# EAGLE design vis-spi-out (EAGLE 9.6.2)

## Sheet 1 of 3
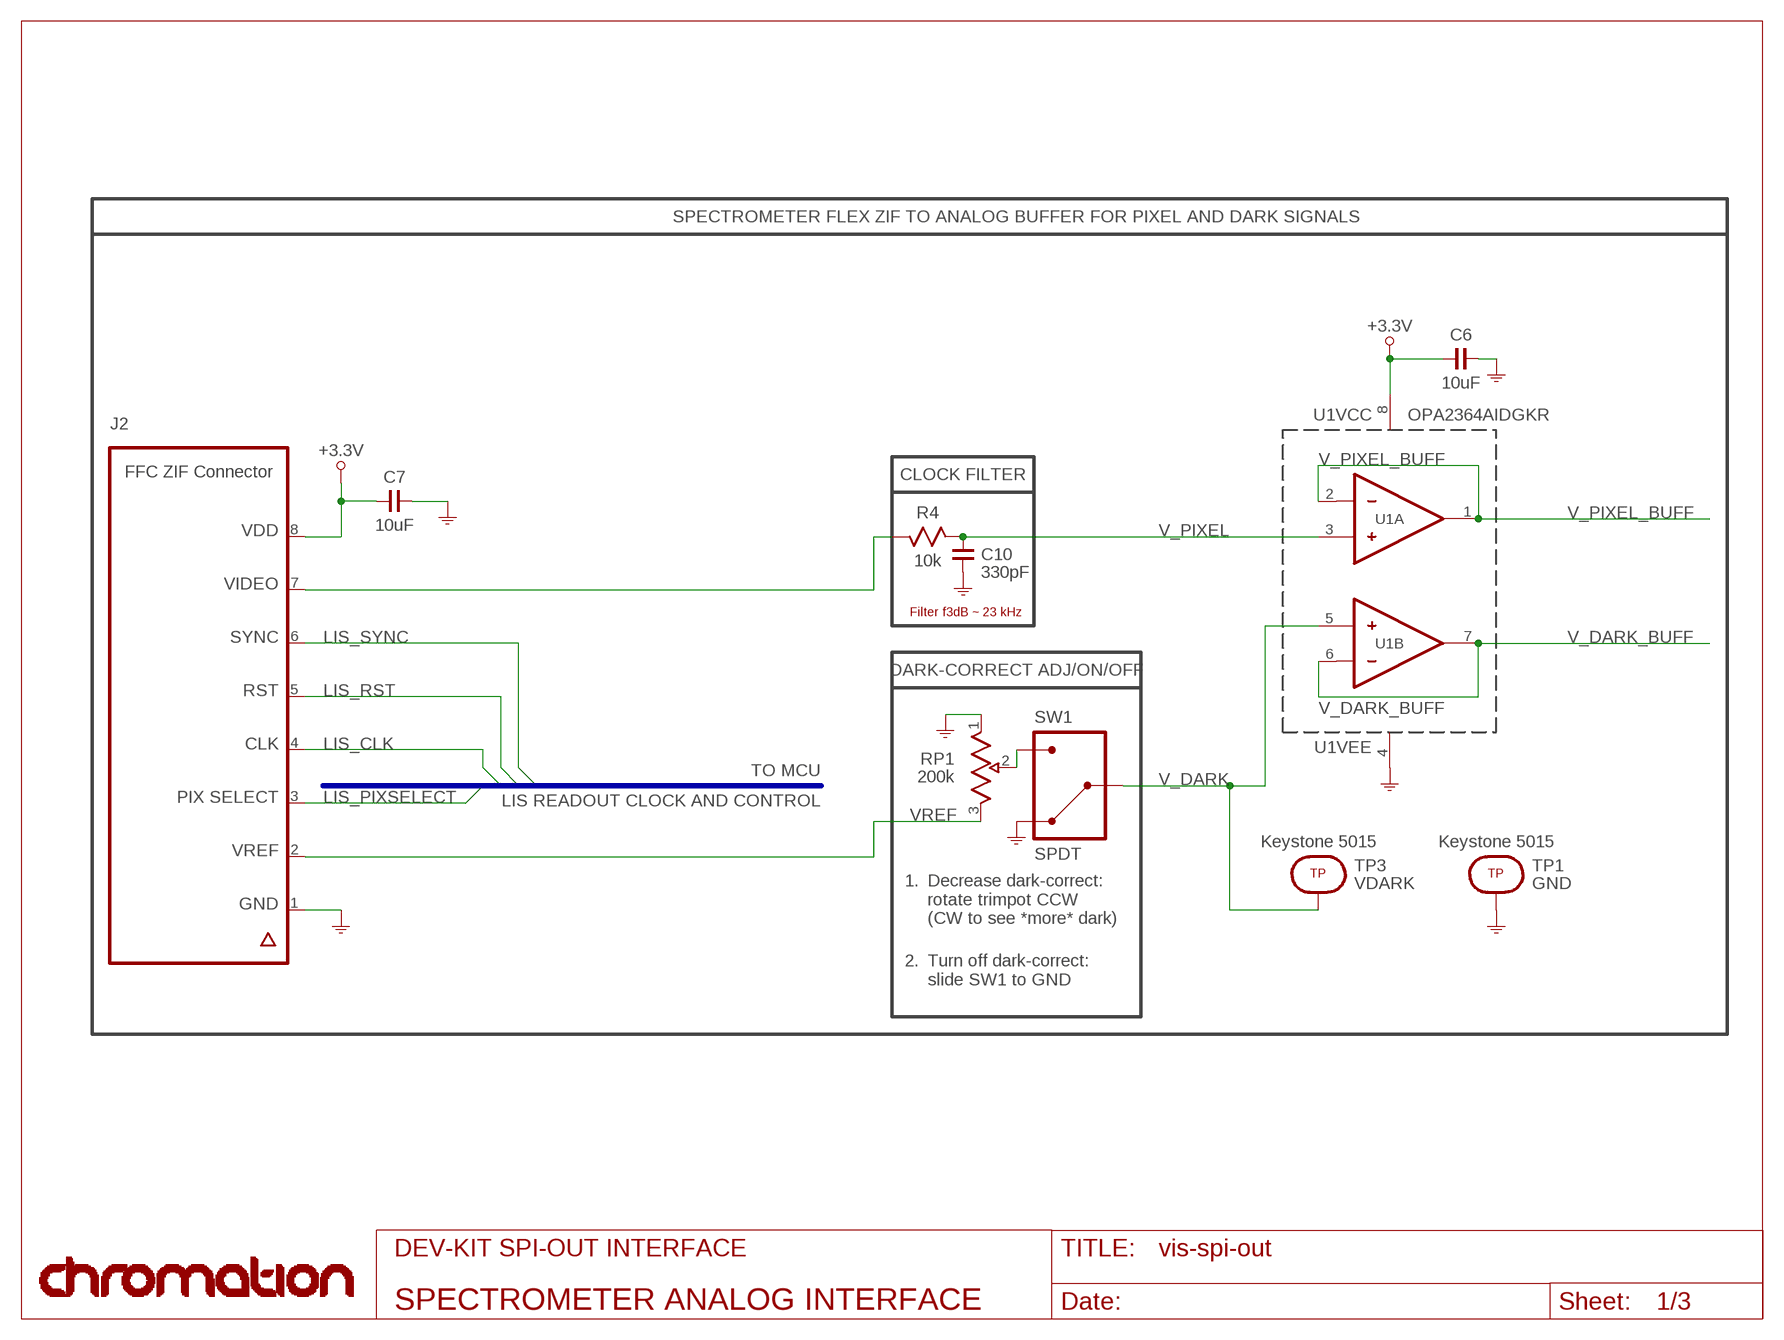
[diagram p0: schematic, sheet 1]

### Parts
C6  10uF  C_0603  [0603]
C7  10uF  C_0603  [0603]
C10  330pF  C_0603  [0603]
J2  FFC ZIF Connector  ZIF_8-PIN  [FH12-8S-0.5SH]
R4  10k  R_0603  [0603]
RP1  200k  TRIMPOT_3MM-SMD  [TC3XX-2-204E]
SW1  SPDT  SW_SPDT_JS102011JCQN  [JS102011JCQN]
TP1  Keystone 5015  TEST-POINT_SMT-5015  [SMT-TEST-POINT-5015]
TP3  Keystone 5015  TEST-POINT_SMT-5015  [SMT-TEST-POINT-5015]
U1  OPA2364AIDGKR  OPA2364_VSSOP-8  [DGK]

### Nets
+3.3V: C6.2 C7.2 J2.8 U1.8(VCC:VCC) ; also sheet 2,3
GND: C6.1 C7.1 C10.2 J2.1 RP1.1(CCW) SW1.3 TP1.1 U1.4(VEE:VEE) ; also sheet 2,3
LIS_CLK: J2.4 ; also sheet 2
LIS_PIXSELECT: J2.3 ; also sheet 2
LIS_RST: J2.5 ; also sheet 2
LIS_SYNC: J2.6 ; also sheet 2
V_DARK: SW1.2 TP3.1 U1.5(B:IN+)
V_DARK_BUFF: U1.6(B:IN-) U1.7(B:OUT) ; also sheet 2
V_PIXEL: C10.1 R4.2 U1.3(A:IN+)
V_PIXEL_BUFF: U1.1(A:OUT) U1.2(A:IN-) ; also sheet 2
VIDEO: J2.7 R4.1
VREF: J2.2 RP1.3(CW)
WIPER: RP1.2(WIPER) SW1.1
Unconnected: J2.LEG@1(LEG) J2.LEG@2(LEG)

### Buses
LIS_PIXSELECT,LIS_CLK,LIS_RST,LIS_SYNC

### Notes on the sheet
- SPECTROMETER FLEX ZIF TO ANALOG BUFFER FOR PIXEL AND DARK SIGNALS
- CLOCK FILTER
- VDD
- VIDEO
- Filter f3dB ~ 23 kHz
- SYNC
- DARK-CORRECT ADJ/ON/OFF
- RST
- CLK
- TO MCU
- LIS READOUT CLOCK AND CONTROL
- PIX SELECT
- VREF
- 1.
- Decrease dark-correct:
  rotate trimpot CCW
  (CW to see *more* dark)
- GND
- 2.
- Turn off dark-correct:
  slide SW1 to GND
- DEV-KIT SPI-OUT INTERFACE
- SPECTROMETER ANALOG INTERFACE

## Sheet 2 of 3
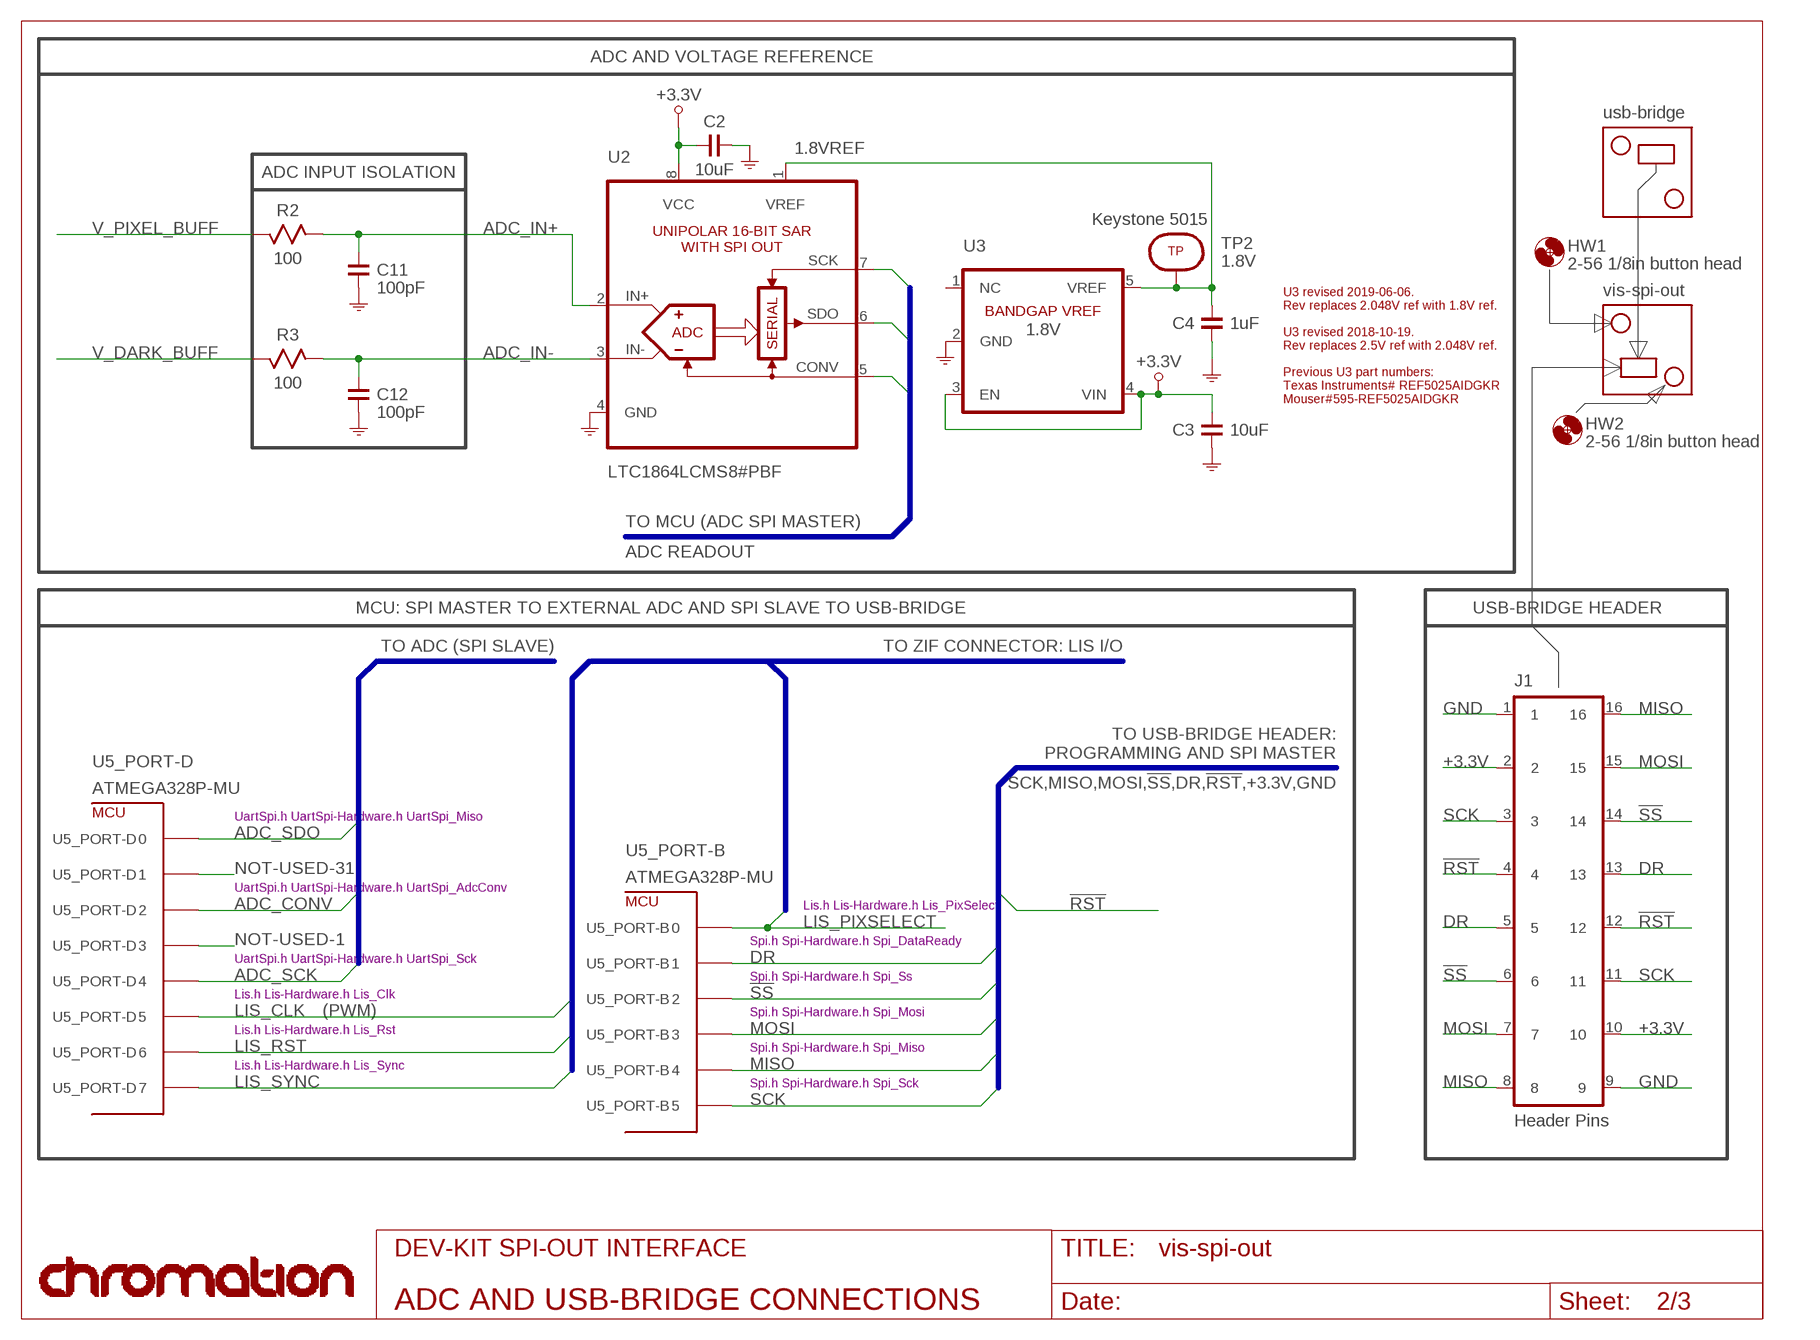
[diagram p1: schematic, sheet 2]

### Parts
C2  10uF  C_0603  [0603]
C3  10uF  C_0603  [0603]
C4  1uF  C_0603  [0603]
C11  100pF  C_0603  [0603]
C12  100pF  C_0603  [0603]
HW1  2-56 1/8in button head  MOUNTING-HOLE_2-56_SCREW  [MCMASTER_92949A081]
HW2  2-56 1/8in button head  MOUNTING-HOLE_2-56_SCREW  [MCMASTER_92949A081]
J1  Header Pins  HEADER-PIN_2X8  [TSM-108-01-S-DV]
R2  100  R_0603  [0603]
R3  100  R_0603  [0603]
ROTATED-USB-BRIDGE-PCB  USB-BRIDGE_FOOTPRINT-AND-USB-REF  [OUTLINE-HEADER-MICROUSB]
TP2  Keystone 5015  TEST-POINT_SMT-5015  [SMT-TEST-POINT-5015]
U2  LTC1864LCMS8#PBF  LTC1864L_CMS8  [LTC1864LCMS8]
U3  1.8V  VREF_SOT23-LM4132  [SOT23]
U5  ATMEGA328P-MU  [QFN-32_ATMEL]
USB-BRDIGE-PCB  USB-BRIDGE_FOOTPRINT-AND-USB-REF  [OUTLINE-HEADER-MICROUSB]

### Nets
1.8VREF: C4.2 TP2.1 U2.1(VREF) U3.5(VREF)
!RST!: J1.4 J1.12 ; also sheet 3
!SS!: J1.6 J1.14 U5.14 U5.14F
+3.3V: C2.2 C3.1 J1.2 J1.10 U2.8(VCC) U3.3(EN) U3.4(VIN) ; also sheet 1,3
ADC_CONV: U2.5(CONV) U5.32 U5.32F
ADC_IN+: C11.1 R2.2 U2.2(IN+)
ADC_IN-: C12.1 R3.2 U2.3(IN-)
ADC_SCK: U2.7(SCK) U5.2 U5.2F
ADC_SDO: U2.6(SDO) U5.30 U5.30F
DR: J1.5 J1.13 U5.13 U5.13F
GND: C2.1 C3.2 C4.1 C11.2 C12.2 J1.1 J1.9 U2.4(GND) U3.2(GND) ; also sheet 1,3
LIS_CLK: U5.9 U5.9F ; also sheet 1
LIS_PIXSELECT: U5.12 U5.12F ; also sheet 1
LIS_RST: U5.10 U5.10F ; also sheet 1
LIS_SYNC: U5.11 U5.11F ; also sheet 1
MISO: J1.8 J1.16 U5.16 U5.16F
MOSI: J1.7 J1.15 U5.15 U5.15F
NOT-USED-1: U5.1 U5.1F
NOT-USED-31: U5.31 U5.31F
SCK: J1.3 J1.11 U5.17 U5.17F
V_DARK_BUFF: R3.1 ; also sheet 1
V_PIXEL_BUFF: R2.1 ; also sheet 1
Unconnected: U3.1(NC)

### Buses
ADC_SCK,ADC_SDO,ADC_CONV
LIS_PIXSELECT,LIS_CLK,LIS_RST,LIS_SYNC
SCK,MISO,MOSI,!SS!,DR,!RST!,+3.3V,GND

### Notes on the sheet
- ADC AND VOLTAGE REFERENCE
- usb-bridge
- ADC INPUT ISOLATION
- U3 revised 2019-06-06.
  Rev replaces 2.048V ref with 1.8V ref.
  
  U3 revised 2018-10-19.
  Rev replaces 2.5V ref with 2.048V ref.
  
  Previous U3 part numbers:
  Texas Instruments# REF5025AIDGKR
  Mouser#595-REF5025AIDGKR
- vis-spi-out
- TO MCU (ADC SPI MASTER)
- ADC READOUT
- MCU: SPI MASTER TO EXTERNAL ADC AND SPI SLAVE TO USB-BRIDGE | USB-BRIDGE HEADER
- TO ADC (SPI SLAVE) | TO ZIF CONNECTOR: LIS I/O
- TO USB-BRIDGE HEADER:
  PROGRAMMING AND SPI MASTER
- UartSpi.h UartSpi-Hardware.h UartSpi_Miso
- UartSpi.h UartSpi-Hardware.h UartSpi_AdcConv
- Lis.h Lis-Hardware.h Lis_PixSelect
- Spi.h Spi-Hardware.h Spi_DataReady
- UartSpi.h UartSpi-Hardware.h UartSpi_Sck
- Spi.h Spi-Hardware.h Spi_Ss
- Lis.h Lis-Hardware.h Lis_Clk
- (PWM) | Spi.h Spi-Hardware.h Spi_Mosi
- Lis.h Lis-Hardware.h Lis_Rst
- Spi.h Spi-Hardware.h Spi_Miso
- Lis.h Lis-Hardware.h Lis_Sync
- Spi.h Spi-Hardware.h Spi_Sck
- DEV-KIT SPI-OUT INTERFACE
- ADC AND USB-BRIDGE CONNECTIONS

## Sheet 3 of 3
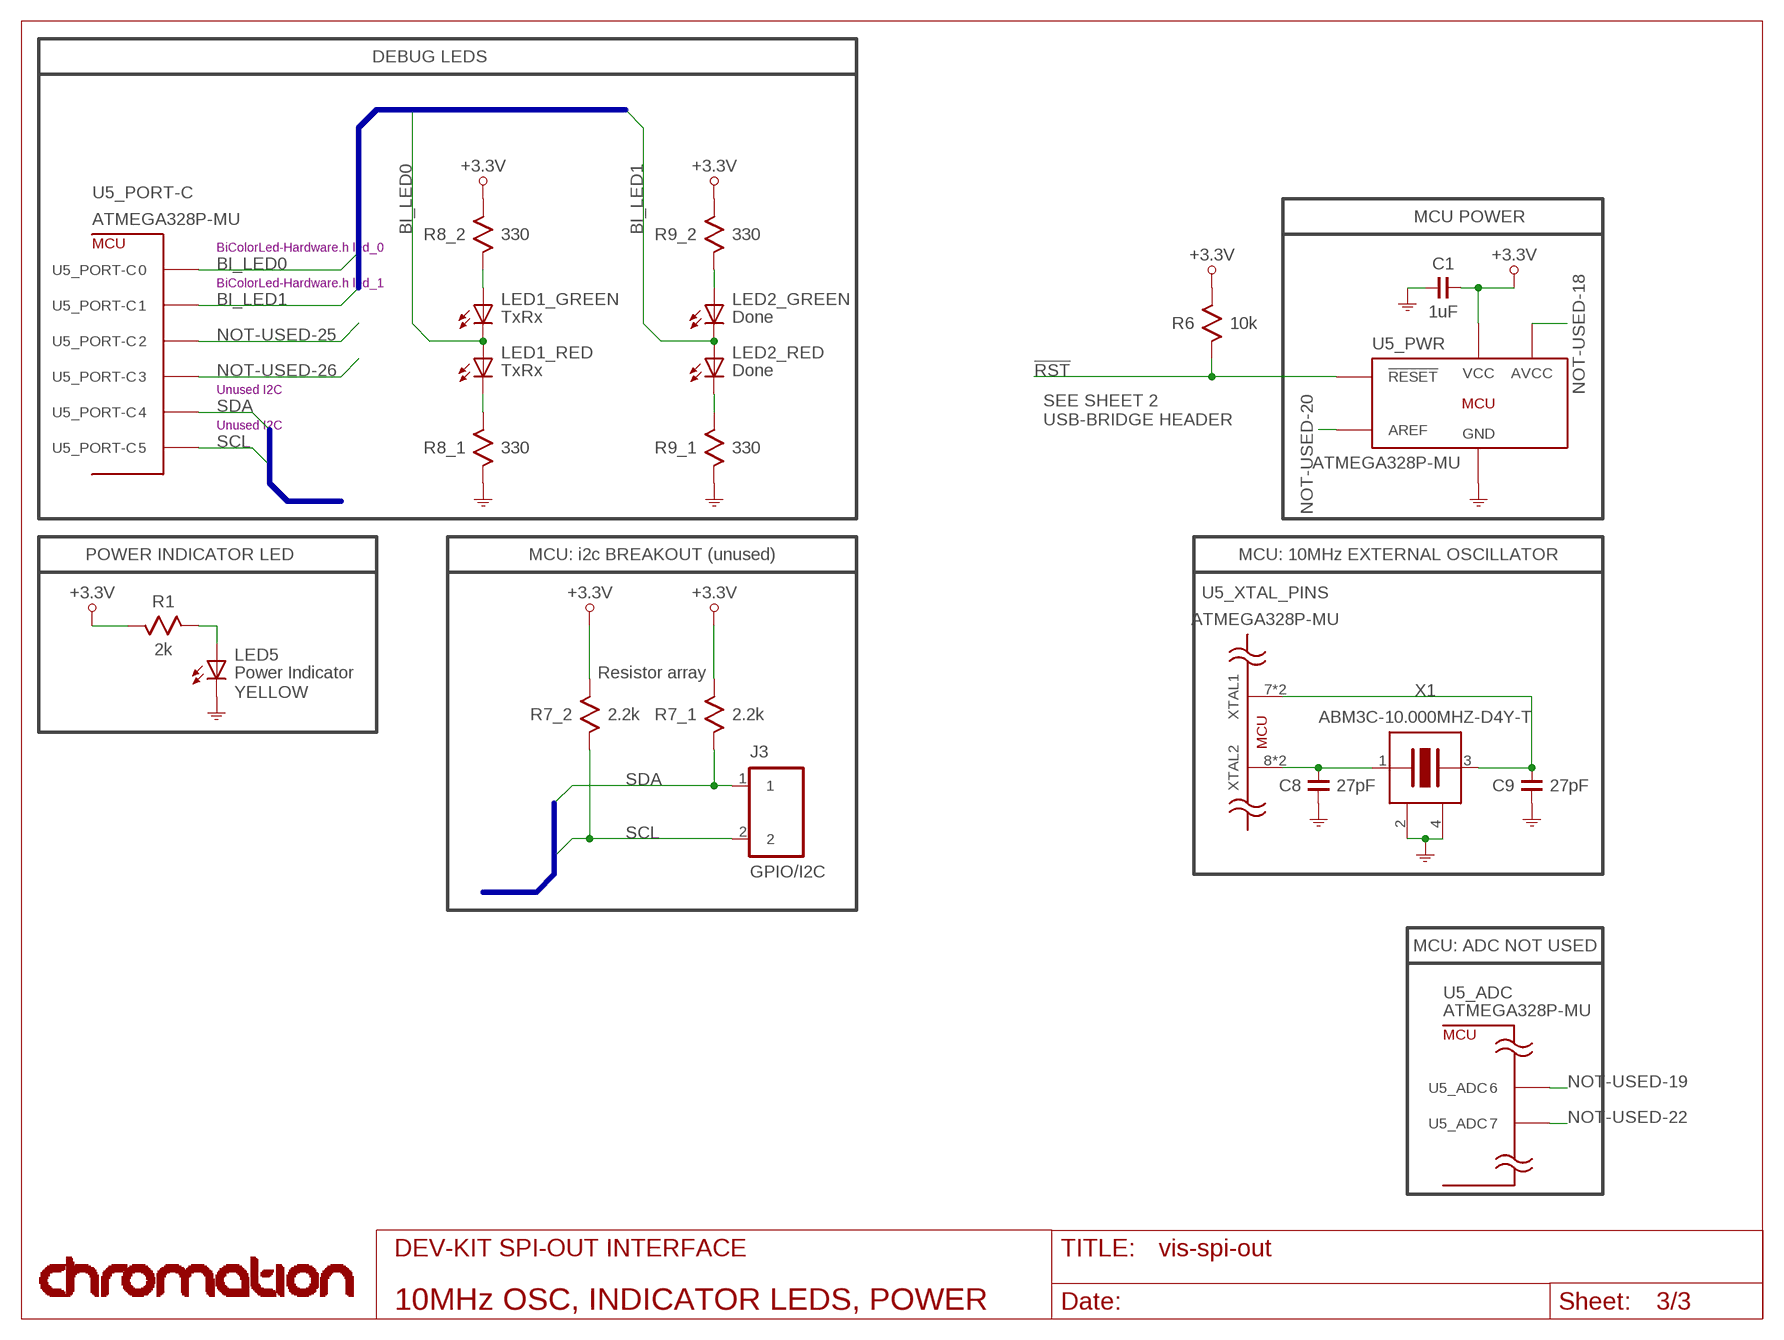
[diagram p2: schematic, sheet 3]

### Parts
C1  1uF  C_0603  [0603]
C8  27pF  C_0603  [0603]
C9  27pF  C_0603  [0603]
J3  GPIO/I2C  HEADER-SOCKET-02_SSM-102-S-SV  [SSM-102-S-SV]
LED1  TxRx  BICOLOR-LED_HSMF-C16X  [HSMF-C16X]
LED2  Done  BICOLOR-LED_HSMF-C16X  [HSMF-C16X]
LED5  Power Indicator  APTD1608SYCK_LED-0603  [LED-0603-KINGBRIGHT]
R1  2k  R_0603  [0603]
R6  10k  R_0603  [0603]
R7  2.2k  R-ARRAY-2_742C043  [742C043]
R8  330  R-ARRAY-2_742C043  [742C043]
R9  330  R-ARRAY-2_742C043  [742C043]
X1  ABM3C-10.000MHZ-D4Y-T  CRYSTAL_ABM3C-10.000MHZ-D4Y-T  [CRYSTAL]

### Nets
!RST!: R6.1 U5.29(_PWR:!RESET!) U5.29F(_PWR:!RESET!) ; also sheet 2
+3.3V: C1.2 R1.1 R6.2 R7.1 R7.3 R8.3 R9.3 U5.4(_PWR:VCC) U5.4F(_PWR:VCC) U5.6(_PWR:VCC) U5.6F(_PWR:VCC) ; also sheet 1,2
BI_LED0: LED1.2(_RED:A) LED1.3(_GREEN:C) U5.23 U5.23F
BI_LED0_GREEN: LED1.1(_GREEN:A) R8.4
BI_LED0_RED: LED1.4(_RED:C) R8.1
BI_LED1: LED2.2(_RED:A) LED2.3(_GREEN:C) U5.24 U5.24F
BI_LED1_GREEN: LED2.1(_GREEN:A) R9.4
BI_LED1_RED: LED2.4(_RED:C) R9.1
GND: C1.1 C8.2 C9.2 LED5.2(C) R8.2 R9.2 U5.3(_PWR:GND) U5.3F(_PWR:GND) U5.5(_PWR:GND) U5.5F(_PWR:GND) U5.21(_PWR:GND) U5.21F(_PWR:GND) U5.THERMAL(_PWR:GND) X1.2(GND) X1.4(GND) ; also sheet 1,2
N$10: LED5.1(A) R1.2
NOT-USED-18: U5.18(_PWR:AVCC) U5.18F(_PWR:AVCC)
NOT-USED-19: U5.19 U5.19F
NOT-USED-20: U5.20(_PWR:AREF) U5.20F(_PWR:AREF)
NOT-USED-22: U5.22 U5.22F
NOT-USED-25: U5.25 U5.25F
NOT-USED-26: U5.26 U5.26F
SCL: J3.2 R7.4 U5.28 U5.28F
SDA: J3.1 R7.2 U5.27 U5.27F
XTAL1: C9.1 U5.7(_XTAL_PINS:XTAL1) U5.7F(_XTAL_PINS:XTAL1) X1.3
XTAL2: C8.1 U5.8(_XTAL_PINS:XTAL2) U5.8F(_XTAL_PINS:XTAL2) X1.1

### Buses
SDA,SCL
BI_LED0,BI_LED1

### Notes on the sheet
- DEBUG LEDS
- MCU POWER
- BiColorLed-Hardware.h led_0
- BiColorLed-Hardware.h led_1
- Unused I2C
- SEE SHEET 2
  USB-BRIDGE HEADER
- Unused I2C
- POWER INDICATOR LED | MCU: i2c BREAKOUT (unused) | MCU: 10MHz EXTERNAL OSCILLATOR
- Resistor array
- YELLOW
- MCU: ADC NOT USED
- DEV-KIT SPI-OUT INTERFACE
- 10MHz OSC, INDICATOR LEDS, POWER

## Library data of the parts
C1 C4 = 0603:C_; EXPORT: YES; MANUF: Yageo; MANUF_PNUM: CC0603KRX5R8BB105; NOTES: 25V X5R 10%; VENDOR1: Mouser; VENDOR1_PNUM: 603-CC603KRX5R8BB105; VENDOR1_PQ_00001: 0.20
C2 C3 C6 C7 = 0603:C_; EXPORT: YES; MANUF: Murata Electronics; MANUF_PNUM: GRM188R6YA106MA73D; NOTES: X5R 35V; VENDOR1: Mouser; VENDOR1_PNUM: 81-GRM188R6YA106MA3D; VENDOR1_PQ_00001: 0.49
C8 C9 = 0603:C_; EXPORT: YES; MANUF: Murata Electronics; MANUF_PNUM: GRM1885C1H270FA01J; NOTES: C0G 1%; VENDOR1: Mouser; VENDOR1_PNUM: 81-GRM185C1H270FA01J; VENDOR1_PQ_00001: 0.18
C10 = 0603:C_; EXPORT: YES; MANUF: Murata Electronics; MANUF_PNUM: GCM1885C2A331FA16D; NOTES: C0G 1%; VENDOR1: Mouser; VENDOR1_PNUM: 81-GCM1885C2A331FA6D; VENDOR1_PQ_00001: 0.26
C11 C12 = 0603:C_; EXPORT: YES; MANUF: Murata Electronics; MANUF_PNUM: GCM1885C2A101FA16D; NOTES: C0G 1%; VENDOR1: Mouser; VENDOR1_PNUM: 81-GCM1885C2A101FA6D; VENDOR1_PQ_00001: 0.24
HW1 HW2 = Chromation:MOUNTING-HOLE_: McMaster mounting hardware.; EXPORT: YES; MANUF: --; MANUF_PNUM: --; NOTES: 2-56 Screw, 1/8-in Long, Socket Head, Hex Drive; VENDOR1: McMaster; VENDOR1_PNUM: 92949A074; VENDOR1_PQ_00001: 0.0553
J1 = HEADER-PIN:HEADER-PIN_; EXPORT: YES; MANUF: Samtec; MANUF_PNUM: TSM-108-01-S-DV-P-TR; NOTES: Mates with header-socket Samtec# SSM-108-F-DV-K-TR; VENDOR1: Mouser; VENDOR1_PNUM: 200-TSM10801SDVPTR; VENDOR1_PQ_00001: 3.38
J2 = ZIF:ZIF_; EXPORT: YES; MANUF: Hirose; MANUF_PNUM: FH12-8S-0.5SH(55); NOTES: ZIF connector for 0.5mm-pitch FFC, 0.27mm-thick flex cable, contacts: 8 circuits, same-side, 4mm long exposed conductor, 8mm-long reinforcement, 0.3mm-thick at reinforced contact.; VENDOR1: Mouser; VENDOR1_PNUM: 798-FH128S05SH55; VENDOR1_PQ_00001: 1.54
J3 = HEADER-SOCKET:HEADER-SOCKET-02; EXPORT: YES; MANUF: Samtec; MANUF_PNUM: SSM-102-S-SV-K-TR; NOTES: 2-pin socket for GPIO or i2c.; VENDOR1: Mouser; VENDOR1_PNUM: 200-SSM102SSVKTR; VENDOR1_PQ_00001: 1.95
LED1 LED2 = BICOLOR-LED:BICOLOR-LED_; EXPORT: YES; MANUF: Avago; MANUF_PNUM: HSMF-C165; NOTES: Bi-color LED; VENDOR1: Digi-Key; VENDOR1_PNUM: 516-1419-1-ND; VENDOR1_PQ_00001: 0.59
LED5 = Chromation:APTD1608SYCK_; EXPORT: YES; MANUF: Kingbright; MANUF_PNUM: APTD1608SYCK; NOTES: Yellow 0603 LED, Vf=1.9V at If=5mA.; VENDOR1: Mouser; VENDOR1_PNUM: 604-APTD1608SYCK; VENDOR1_PQ_00001: 0.26
R1 = YAGEO-0603:R_; EXPORT: YES; MANUF: Yageo; MANUF_PNUM: RC0603FR-072KL; NOTES: 1% resistance tolerance. 5% substitution is allowed. Was 390 Ohms on first qty 6 order.; VENDOR1: Mouser; VENDOR1_PNUM: 603-RC0603FR-072KL; VENDOR1_PQ_00001: 0.10
R2 R3 = YAGEO-0603:R_; EXPORT: YES; MANUF: Yageo; MANUF_PNUM: RC0603FR-07100RL; NOTES: 1% resistance tolerance; VENDOR1: Mouser; VENDOR1_PNUM: 603-RC0603FR-07100RL; VENDOR1_PQ_00001: 0.10
R4 R6 = YAGEO-0603:R_; EXPORT: YES; MANUF: Yageo; MANUF_PNUM: RC0603FR-0710KL; NOTES: 1% resistance tolerance; VENDOR1: Mouser; VENDOR1_PNUM: 603-RC0603FR-0710KL; VENDOR1_PQ_00001: 0.10
R7 = R-ARRAY:R-ARRAY-2_; EXPORT: YES; MANUF: CTS Electronic Components; MANUF_PNUM: 742C043222JP; NOTES: Array of 2 isolated resistors, 5% resistance tolerance, concave terminations.; VENDOR1: Mouser; VENDOR1_PNUM: 774-742C043222JP; VENDOR1_PQ_00001: 0.10
R8 R9 = R-ARRAY:R-ARRAY-2_; EXPORT: YES; MANUF: CTS Electronic Components; MANUF_PNUM: 742C043331JP; NOTES: Array of 2 isolated resistors, 5% resistance tolerance, concave terminations.; VENDOR1: Mouser; VENDOR1_PNUM: 774-742C043331JP; VENDOR1_PQ_00001: 0.21
ROTATED-USB-BRIDGE-PCB USB-BRDIGE-PCB = USB-BRIDGE:USB-BRIDGE_; EXPORT: YES; NOTES: --; VENDOR1_PQ_00001: --
RP1 = POT:TRIMPOT_; EXPORT: YES; MANUF: Bourns; MANUF_PNUM: TC33X-2-204E; NOTES: 3mm SMD trimpot, +/- 25% tolerance; VENDOR1: Mouser; VENDOR1_PNUM: 652-TC33X-2-204E; VENDOR1_PQ_00001: 0.26
SW1 = SPDT:SW_SPDT_; EXPORT: YES; MANUF: C&K; MANUF_PNUM: JS102011JCQN; NOTES: SPDT SMT slide switch; VENDOR1: Mouser; VENDOR1_PNUM: 611-JS102011JCQN; VENDOR1_PQ_00001: 0.71
TP1 = TEST-POINT:TEST-POINT_; EXPORT: YES; MANUF: Keystone Electronics; MANUF_PNUM: 5015; NOTES: surface mount test point; TP_SIGNAL_NAME: GND; VENDOR1: Mouser; VENDOR1_PNUM: 534-5015; VENDOR1_PQ_00001: 0.35
TP2 = TEST-POINT:TEST-POINT_; EXPORT: YES; MANUF: Keystone Electronics; MANUF_PNUM: 5015; NOTES: surface mount test point; TP_SIGNAL_NAME: 1.8V; VENDOR1: Mouser; VENDOR1_PNUM: 534-5015; VENDOR1_PQ_00001: 0.35
TP3 = TEST-POINT:TEST-POINT_; EXPORT: YES; MANUF: Keystone Electronics; MANUF_PNUM: 5015; NOTES: surface mount test point; TP_SIGNAL_NAME: VDARK; VENDOR1: Mouser; VENDOR1_PNUM: 534-5015; VENDOR1_PQ_00001: 0.35
U1 = Chromation:OPA2364_; EXPORT: YES; MANUF: Texas Instruments; MANUF_PNUM: OPA2364AIDGKR; NOTES: Dual op-amp to drive the SAR ADC S/H input. Settles to 0.01% (6.5LSB) in 1.5us.; VENDOR1: Mouser; VENDOR1_PNUM: 595-OPA2364AIDGKR; VENDOR1_PQ_00001: 2.64
U2 = 20151020_LIS-770i_mBrd:LTC1864L_; EXPORT: YES; MANUF: Linear Technology; MANUF_PNUM: LTC1864LCMS8#PBF; NOTES: 16-bit ADC, 150kSPS, unipolar transfer function, differential input, SPI output.; VENDOR1: Digi-Key; VENDOR1_PNUM: LTC1864LCMS8#PBF-ND; VENDOR1_PQ_00001: 14.39
U3 = VREF:VREF_; EXPORT: YES; MANUF: Texas Instruments; MANUF_PNUM: LM4132AMF-1.8/NOPB; NOTES: 1.8V band gap precision voltage reference; VENDOR1: Digi-Key; VENDOR1_PNUM: LM4132AMF-1.8/NOPBCT-ND; VENDOR1_PQ_00001: 3.12
U5 = ATMEGA328:ATMEGA328P-; EXPORT: YES; MANUF: Atmel; MANUF_PNUM: ATMEGA328P-MUR; NOTES: 8-bit MCU: 10MHz at 3.3V, two SPI, and a PWM.; VENDOR1: Mouser; VENDOR1_PNUM: 556-ATMEGA328P-MUR; VENDOR1_PQ_00001: 3.57
X1 = CRYSTAL:CRYSTAL_; EXPORT: YES; MANUF: ABRACON; MANUF_PNUM: ABM3C-10.000MHZ-D4Y-T; NOTES: 10MHz crystal oscillator SMT 4-pads; VENDOR1: Mouser; VENDOR1_PNUM: 815-ABM3C-10-D4YT; VENDOR1_PQ_00001: 0.69

## Board
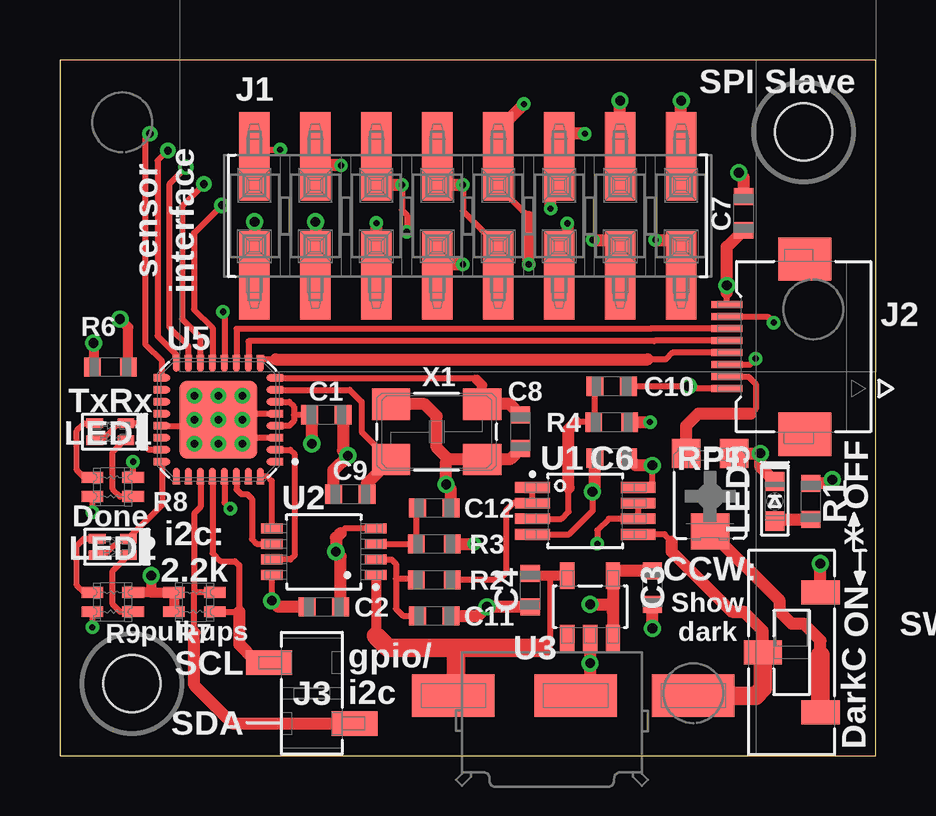
[diagram p3: board, top side]
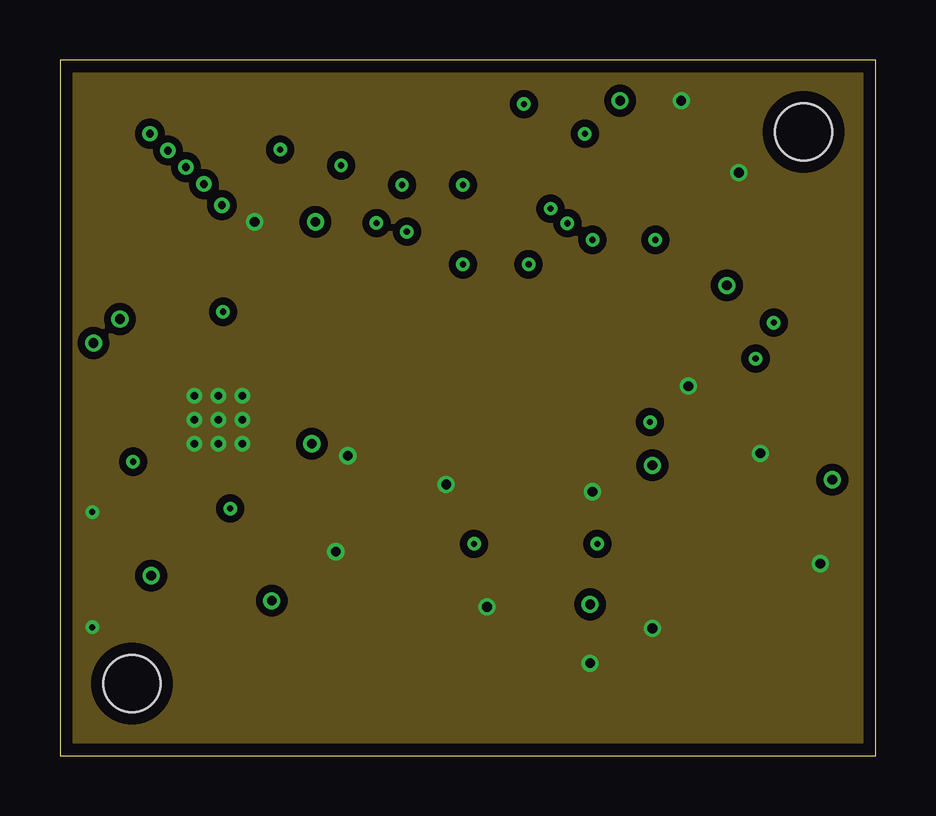
[diagram p4: board, inner layer Route2]
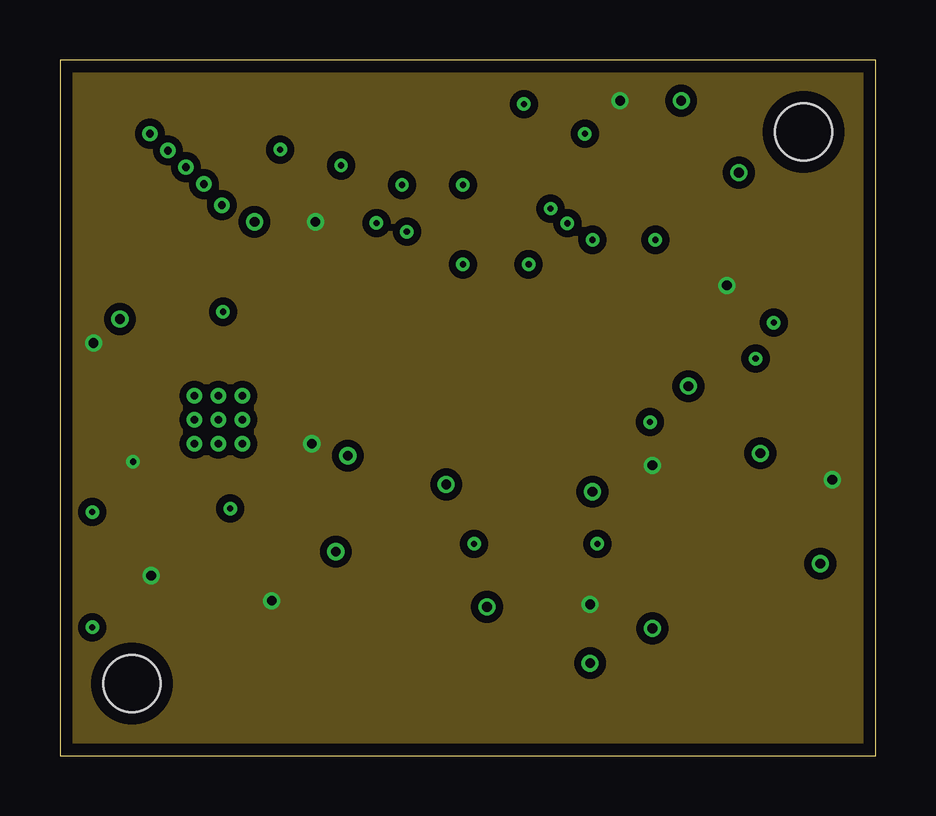
[diagram p5: board, inner layer Route15]
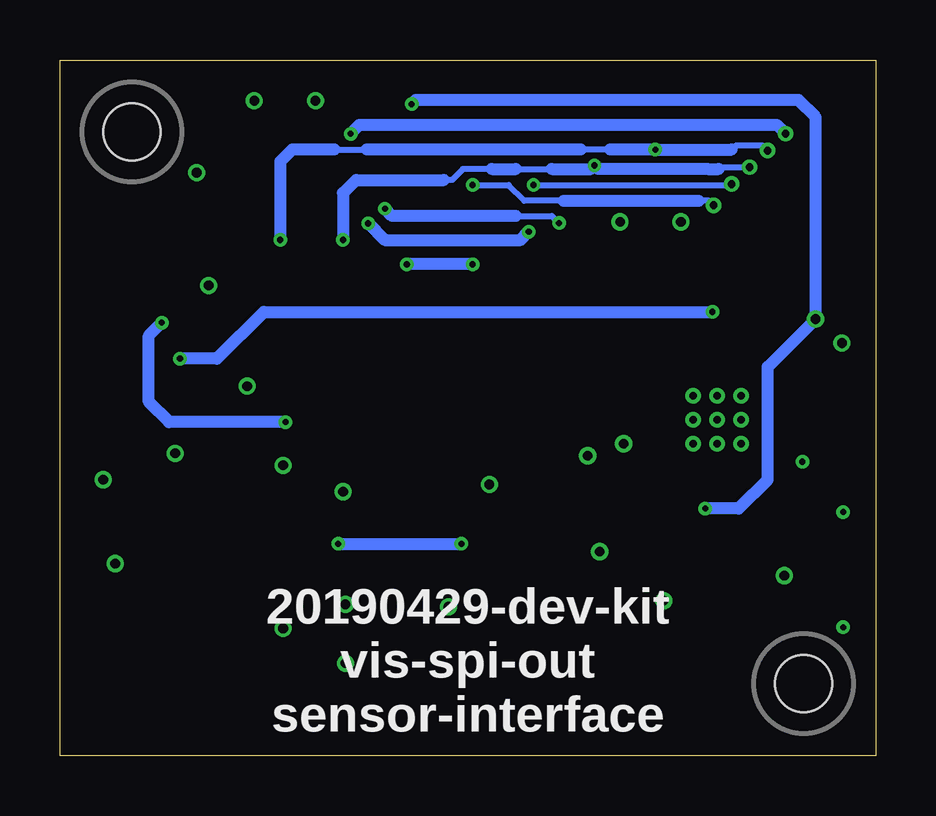
[diagram p6: board, bottom side, seen from below]

Size 34 x 29 mm. Coordinates in mm from the lower left corner, seen from the top.
Outline: 0,0 34,0 34,29 0,29 0,0
Copper layers (1*2*15*16): Top 0.035mm / dielectric 0.23mm / Route2 0.035mm / dielectric 0.93mm / Route15 0.035mm / dielectric 0.23mm / Bottom 0.035mm
Design rules "Conservative-clearance-check-before-PCB-NG-check": minimum track width 5mil, minimum drill 10mil, track to track 9mil, track to pad 8mil, pad to pad 7mil, via to via 10mil, smd to smd 0mil, copper to edge 20mil, drill to drill 8mil, minimum pad ring 8mil, minimum via ring 6mil, stop-mask expansion 4mil, vias tented up to drill 100mil, thermal gap 10mil

### Footprints (pad centres in the part's own frame; a part is rotated, then mirrored left to right if it is on the bottom)
0603 = smd 0.7 x 0.8: 1 -0.7,0; 2 0.7,0
MCMASTER_92949A081 = hole 2.388: 0,0
TSM-108-01-S-DV = smd 1.27 x 3.683: 1 -8.89,-2.477; 2 -6.35,-2.477; 3 -3.81,-2.477; 4 -1.27,-2.477; 5 1.27,-2.477; 6 3.81,-2.477; 7 6.35,-2.477; 8 8.89,-2.477; 9 8.89,2.477; 10 6.35,2.477; 11 3.81,2.477; 12 1.27,2.477; 13 -1.27,2.477; 14 -3.81,2.477; 15 -6.35,2.477; 16 -8.89,2.477
FH12-8S-0.5SH = smd 0.3 x 1.3: 1 1.75,-3.2; 2 1.25,-3.2; 3 0.75,-3.2; 4 0.25,-3.2; 5 -0.25,-3.2; 6 -0.75,-3.2; 7 -1.25,-3.2; 8 -1.75,-3.2 | smd 1.8 x 2.2: LEG@1 -3.65,0.05; LEG@2 3.65,0.05
SSM-102-S-SV = smd 1.02 x 1.905: 1 -1.27,-1.778; 2 1.27,1.778
HSMF-C16X = smd 0.7 x 0.4: 1 -0.65,0.35; 2 -0.65,-0.35; 3 0.65,0.35; 4 0.65,-0.35
LED-0603-KINGBRIGHT = smd 0.8 x 0.8: 1 -0.825,0; 2 0.825,0
0603' = smd 0.7 x 0.8: 1 -0.75,0; 2 0.75,0
742C043 = smd 0.45 x 0.9: 1 -0.4,-0.85; 2 -0.4,0.85; 3 0.4,-0.85; 4 0.4,0.85
TC3XX-2-204E = smd 1.2 x 1.2: 1 -1,-1.8; 3 1,-1.8 | smd 1.6 x 1.5: 2 0,1.45
JS102011JCQN = smd 1 x 1.6: 1 -2.5,-1.2; 2 0,1.2; 3 2.5,-1.2
SMT-TEST-POINT-5015 = smd 3.43 x 1.78: 1 0,0
DGK = smd 0.45 x 1.45: 1 -0.975,-2.2; 2 -0.325,-2.2; 3 0.325,-2.2; 4 0.975,-2.2; 5 0.975,2.2; 6 0.325,2.2; 7 -0.325,2.2; 8 -0.975,2.2
LTC1864LCMS8 = smd 0.89 x 0.42: 1 -2.17,0.975; 2 -2.17,0.325; 3 -2.17,-0.325; 4 -2.17,-0.975; 5 2.17,-0.975; 6 2.17,-0.325; 7 2.17,0.325; 8 2.17,0.975
SOT23 = smd 1.1 x 0.6: 1 -1.3,0.95; 2 -1.3,0; 3 -1.3,-0.95; 4 1.3,-0.95; 5 1.3,0.95
QFN-32_ATMEL = smd 0.7 x 0.3: 1 -2.35,1.75; 2 -2.35,1.25; 3 -2.35,0.75; 4 -2.35,0.25; 5 -2.35,-0.25; 6 -2.35,-0.75; 7 -2.35,-1.25; 8 -2.35,-1.75; 17 2.35,-1.75; 18 2.35,-1.25; 19 2.35,-0.75; 20 2.35,-0.25; 21 2.35,0.25; 22 2.35,0.75; 23 2.35,1.25; 24 2.35,1.75 | smd 0.15 x 0.3: 1F -2.625,1.75; 2F -2.625,1.25; 3F -2.625,0.75; 4F -2.625,0.25; 5F -2.625,-0.25; 6F -2.625,-0.75; 7F -2.625,-1.25; 8F -2.625,-1.75; 17F 2.625,-1.75; 18F 2.625,-1.25; 19F 2.625,-0.75; 20F 2.625,-0.25; 21F 2.625,0.25; 22F 2.625,0.75; 23F 2.625,1.25; 24F 2.625,1.75 | smd 0.3 x 0.7: 9 -1.75,-2.35; 10 -1.25,-2.35; 11 -0.75,-2.35; 12 -0.25,-2.35; 13 0.25,-2.35; 14 0.75,-2.35; 15 1.25,-2.35; 16 1.75,-2.35; 25 1.75,2.35; 26 1.25,2.35; 27 0.75,2.35; 28 0.25,2.35; 29 -0.25,2.35; 30 -0.75,2.35; 31 -1.25,2.35; 32 -1.75,2.35 | smd 0.3 x 0.15: 9F -1.75,-2.625; 10F -1.25,-2.625; 11F -0.75,-2.625; 12F -0.25,-2.625; 13F 0.25,-2.625; 14F 0.75,-2.625; 15F 1.25,-2.625; 16F 1.75,-2.625; 25F 1.75,2.625; 26F 1.25,2.625; 27F 0.75,2.625; 28F 0.25,2.625; 29F -0.25,2.625; 30F -0.75,2.625; 31F -1.25,2.625; 32F -1.75,2.625 | smd 3.25 x 3.25: THERMAL 0,0
CRYSTAL = smd 1.6 x 1.3: 1 -1.9,-1.15; 2 1.9,-1.15; 3 1.9,1.15; 4 -1.9,1.15

### Placement (x,y rotation side)
C1  11.1,14.2 180 top
C2  11,6.2 180 top
C3  24.7,7 270 top
C4  19.6,6.9 90 top
C6  23,12.4 0 top
C7  28.5,22.6 270 top
C8  19.2,13.5 270 top
C9  12.1,10.9 180 top
C10  23,15.4 0 top
C11  15.6,5.83 0 top
C12  15.6,10.32 0 top
HW1  31,26 0 top
HW2  3,3 0 top
J1  17,22.5 0 top
J2  31,17.05 270 top
J3  10.5,2.6 90 top
LED1  2.1,13.5 0 top
LED2  2.2,8.7 0 top
LED5  29.8,10.6 90 top
R1  2k  [0603']  31.3,10.6 270 top
R2  100  [0603']  15.6,7.33 180 top
R3  100  [0603']  15.6,8.82 180 top
R4  10k  [0603']  23,13.9 180 top
R6  10k  [0603']  2.1,16.2 180 top
R7  5.6,6.4 270 top
R8  2.2,11.2 90 top
R9  2.2,6.4 90 top
ROTATED-USB-BRIDGE-PCB  34,45 180 top  (outside the outline)
RP1  27.1,10.8 180 top
SW1  30.5,4.3 90 top
TP1  21.5,2.5 0 top
TP2  16.4,2.5 0 top
TP3  26.4,2.5 0 top
U1  21.9,10.2 270 top
U2  11,8.5 180 top
U3  22.1,6.2 90 top
U5  6.6,14 180 top
USB-BRDIGE-PCB  0,0 0 top
X1  15.7,13.5 180 top

### Tracks (layer width: path | path; a pad name or v marks a point on that pad's centre or on a via)
1.8VREF
  Top 0.254: 20.15,4.5 20.45,4.8 20.45,7.5 | 16.5,3.04 16.5,2.6 TP2.1
  Top 0.406: U2.1 13.17,5 | U3.5 20.45,7.5 19.6,7.5 C4.2
  Top 0.762: 13.17,5 13.67,4.5 16.5,4.5 | 16.5,4.5 20.15,4.5 | 16.5,3.04 16.5,4.5
!RST!  (via drill 0.25, 0.41)
  Top 0.127: U5.29 U5.29F
  Top 0.254: 18.67,26.56 18.27,26.16 J1.12 18.27,23.73 19.54,22.46 | J1.4 15.73,20.08 16.13,20.48 | U5.29F 6.85,10.55 v7.1,10.3
  Top 0.406: R6.1 2.85,17.85 v2.5,18.2
  Top 0.508: v19.54,20.48 19.54,22.46 | 16.13,20.48 v16.8,20.48 | 18.67,26.56 18.74,26.56 v19.34,27.16
  Bottom 0.508: v7.1,10.3 5.7,10.3 4.5,11.5 4.5,16.2 v2.5,18.2 2.5,26.61 3.21,27.32 19.18,27.32 v19.34,27.16 | v16.8,20.48 v19.54,20.48
!SS!  (via drill 0.25, 0.33)
  Top 0.254: v14.26,23.79 14.26,22.74 14.46,22.54 v14.46,21.84 | J1.6 20.81,20.57 21.15,20.91 | U5.14F U5.14 5.85,17.43 5.08,18.2 5.08,22.91 v6,23.83
  Top 0.508: v21.15,22.19 21.15,20.91 | v14.26,23.79 13.5,23.79 13.5,24 13.19,24 J1.14
  Bottom 0.254: v14.26,23.79 6.04,23.79 v6,23.83
  Bottom 0.508: v21.15,22.19 20.46,21.5 14.8,21.5 v14.46,21.84
+3.3V  (via drill 0.25, 0.41)
  Top 0.127: U5.4 U5.4F | U5.6 U5.6F
  Top 0.254: 9.75,14.2 9.75,13.95 9.55,13.75 U5.4F | U5.6F 9.55,14.75 9.75,14.55 9.75,14.2 | 24.2,11.28 U1.8 24.7,11.18 v24.7,12.1 | C1.2 9.75,14.2 | J2.8 27.8,19.3 | R8.3 v3.05,12.25 | 23.05,6.3 23.05,6 | 1.4,16.25 R6.2 | U2.8 v8.83,6.45
  Top 0.406: v1.4,17.2 1.4,16.25 | v3.8,7.5 3.8,6.8 | 3.8,6.8 R9.3 | 3.8,6.8 R7.1 R7.3
  Top 0.508: U3.3 23.05,6 U3.4 23.25,7.7 C3.1 | v22.1,6.3 23.05,6.3 | 27.8,19.3 v27.8,19.6 27.8,21.2 C7.2 | J1.10 v23.35,27.3 | v10.65,22.25 J1.2 | v10.5,13 10.5,14.1 C1.2 | v24.7,12.1 24,12.1 C6.2 | C2.2 9.08,6.2 v8.83,6.45 | v32.2,11.5 32.05,11.35 R1.1
  pour Route15 (isolate 0.305, rank 2): 0,0 34,0 34,29 0,29
ADC_CONV
  Top 0.127: U5.32F U5.32
  Top 0.254: U2.5 8.83,11.45 8.63,11.65 U5.32
ADC_IN+
  Top 0.254: R2.2 14.85,7.38 14,7.38 | U2.2 13.82,8.18 14,8 14,7.38 | 14,7.38 14,6.12 14.3,5.83 C11.1
ADC_IN-
  Top 0.254: C12.1 14.85,10.32 R3.2 U2.3
ADC_SCK
  Top 0.127: U5.2 U5.2F
  Top 0.254: U2.7 9.6,8.18 9.8,8.38 9.8,12.55 9.6,12.75 U5.2F
ADC_SDO
  Top 0.127: U5.30F U5.30
  Top 0.254: U5.30F 7.35,11.1 7.55,10.9 7.8,10.9 8,10.7 8,9.03 8.2,8.82 U2.6
BI_LED0
  Top 0.127: U5.23 U5.23F
  Top 0.203: LED1.2 1.75,13.15 2.45,13.85 LED1.3
  Top 0.254: U5.23F 3.7,12.75 3.5,12.95 3.5,13.6 3.25,13.85 LED1.3
BI_LED0_GREEN
  Top 0.254: R8.4 1,11.6 0.7,11.9 0.7,13.55 1,13.85 LED1.1
BI_LED0_RED
  Top 0.254: R8.1 2.5,10.8 2.2,11.1 2.2,12.65 2.7,13.15 LED1.4
BI_LED1
  Top 0.127: U5.24 U5.24F
  Top 0.203: LED2.2 1.85,8.35 2.55,9.05 LED2.3
  Top 0.254: U5.24 4.25,10.45 LED2.3
BI_LED1_GREEN
  Top 0.254: R9.4 1,6.8 0.7,7.1 0.7,8.75 1,9.05 LED2.1
BI_LED1_RED
  Top 0.254: R9.1 2.5,6 2.2,6.3 2.2,7.7 LED2.4
DR  (via drill 0.25, 0.33)
  Top 0.254: J1.5 18.27,21.7 17.8,21.7 16.8,22.7 v16.8,23.79 | 15.73,23.79 J1.13 | U5.13 U5.13F 6.35,17.84 5.59,18.6 5.59,21.78 v6.75,22.94
  Top 0.508: v16.8,23.79 15.73,23.79
  Bottom 0.254: 7.37,23.13 6.94,23.13 v6.75,22.94 | 13,23.13 14.64,23.13 15.3,23.79 v16.8,23.79
  Bottom 0.508: 13,23.13 7.37,23.13
GND  (via drill 0.25, 0.33, 0.41)
  Top 0.127: U5.21 U5.21F | U5.3 U5.3F | U5.5 U5.5F
  Top 0.254: U5.21 5.6,13.75 v5.6,14 | U5.5 7.6,14.25 v7.6,14 7.6,13.25 U5.3 | U2.4 11.9,9.47 11.7,9.28 | R8.2 v1.35,10.15 | R9.2 v1.35,5.35 | C12.2 16.3,10.5 | J2.1 26.3,15.3 v26.2,15.4 C10.2 | v22.2,11 22.2,10.2 21.23,9.22 U1.4
  Top 0.5: 22.3,11.1 v22.2,11
  Top 0.508: C8.2 18.75,12.35 X1.4 16.2,12.35 | U3.2 v22.1,3.85 22.1,3.1 TP1.1 | v24.7,5.3 C3.2 | J1.9 v25.89,27.29 v25.9,27.3 | v8.11,22.25 J1.1 | C7.1 28.5,24.1 v28.3,24.3 | C1.1 11.8,12.7 v12,12.5 11.4,11.9 C9.2 | C4.1 v17.8,6.2 17.43,5.83 C11.2 | C2.1 11.7,8.3 v11.5,8.5 11.5,9.07 11.7,9.28 | SW1.3 v31.7,8 | RP1.1 v29.2,12.6 29.2,12.03 LED5.2 | 22.3,11.1 C6.1 | 16.3,10.5 16.3,11.1 v16.1,11.3 16.1,12.25 16.2,12.35 | 14.3,14.65 X1.2 15.2,14.65 15.7,14.15 15.7,12.85 16.2,12.35
  other vias: 6.6,15 6.6,13 7.6,15 7.6,13 5.6,15 5.6,13 6.6,14
  pour Route2 (isolate 0.305, rank 3): 0,29 0,0 34,0 34,29
LIS_CLK
  Top 0.127: 8.35,16.51 U5.9F
  Top 0.254: 24.5,16.51 25.25,16.51 25.54,16.8 J2.4 | 9,16.51 8.35,16.51 U5.9
  Top 0.508: 9,16.51 24.5,16.51
LIS_PIXSELECT  (via drill 0.25)
  Top 0.127: U5.12 U5.12F
  Top 0.254: J2.3 28.75,16.3 v29,16.55 | U5.12F 6.85,18.45 v6.8,18.5
  Bottom 0.508: v6.8,18.5 25.5,18.5 27.45,16.55 v29,16.55
LIS_RST
  Top 0.254: U5.10 U5.10F 7.85,17.28 24.77,17.28 24.79,17.3 J2.5
LIS_SYNC
  Top 0.254: U5.11 U5.11F 7.35,17.78 24.6,17.78 24.62,17.8 J2.6
MISO  (via drill 0.25, 0.33)
  Top 0.127: U5.16F 4.85,16.7
  Top 0.254: J1.16 8.4,25.27 v9.18,25.27 | 25.49,21.5 25.89,21.1 J1.8 | U5.16 4.85,16.7 4.07,17.49 4.07,24.79 v4.5,25.23
  Top 0.508: v24.82,21.5 25.49,21.5
  Bottom 0.254: v4.5,25.23 4.69,25.42 5.84,25.42 5.99,25.27 | 11.06,25.27 12.3,25.27 | 22.57,25.27 21.2,25.27
  Bottom 0.508: 11.06,25.27 v9.18,25.27 5.99,25.27 | 12.3,25.27 21.2,25.27 | 22.57,25.27 24.32,25.27 24.82,24.77 v24.82,21.5
MOSI  (via drill 0.25, 0.33)
  Top 0.127: U5.15F U5.15
  Top 0.254: 11.02,24.6 J1.15 | 22.95,21.5 23.35,21.1 J1.7 | U5.15F 5.35,17.05 4.58,17.82 4.58,23.85 v5.25,24.53
  Top 0.508: v11.72,24.6 11.02,24.6 | v22.2,21.5 22.95,21.5
  Bottom 0.254: v5.25,24.53 6.47,24.53 6.55,24.45 | 18,24 17.65,24 17.2,24.45 16,24.45 | 15,24.45 13.5,24.45
  Bottom 0.508: v22.2,21.5 22.2,23.45 21.65,24 18,24 | 16,24.45 15,24.45 | 13.5,24.45 11.87,24.45 v11.72,24.6 11.57,24.45 7,24.45 6.55,24.45
N$10
  Top 0.508: LED5.1 29.88,9.85 R1.2
NOT-USED-1
  Top 0.127: U5.1 U5.1F
NOT-USED-18
  Top 0.127: U5.18 U5.18F
NOT-USED-19
  Top 0.127: U5.19 U5.19F
NOT-USED-20
  Top 0.127: U5.20 U5.20F
NOT-USED-22
  Top 0.127: U5.22 U5.22F
NOT-USED-25
  Top 0.127: U5.25 U5.25F
NOT-USED-26
  Top 0.127: U5.26 U5.26F
NOT-USED-31
  Top 0.127: U5.31F U5.31
SCK  (via drill 0.25, 0.33)
  Top 0.127: U5.17 U5.17F
  Top 0.254: 20.45,24.62 J1.11 | U5.17 4.25,16.45 3.56,17.14 3.56,25.73 v3.75,25.93
  Top 0.508: J1.3 v13.19,22.2 | v20.45,22.8 20.45,24.62 | v21.88,25.93 20.81,25.93 J1.11
  Bottom 0.254: 15,22.5 13.49,22.5 v13.19,22.2
  Bottom 0.508: 15,22.5 20.15,22.5 v20.45,22.8 | v3.75,25.93 4.12,26.29 21.51,26.29 v21.88,25.93
SCL
  Top 0.127: U5.28 U5.28F
  Top 0.254: U5.28F 6.35,8.45 6.7,8.1 7.3,8.1 7.47,7.93 7.47,6 R7.4 | 8.1,4 8.59,4 J3.2
  Top 0.508: 7.47,6 7.47,4.63 8.1,4
SDA
  Top 0.127: U5.27 U5.27F
  Top 0.254: U5.27F 5.85,10.35 5.6,10.1 5.6,6.8 | 5.6,5.13 5.6,6.8 | R7.2 5.6,6.8
  Top 0.508: J3.1 7.2,1.33 5.6,2.93 5.6,5.13
V_DARK
  Top 0.254: 25.5,8.93 25.2,9.22 U1.5
  Top 0.508: SW1.2 29.3,5.2 28.5,6 28,6 25.5,8.5 25.5,8.93
  Top 0.762: TP3.1 29,2.5 29.3,2.8 SW1.2
V_DARK_BUFF  (via drill 0.25)
  Top 0.254: U1.7 U1.6 22.88,9.88 22.4,9.4 v22.4,8.82
  Top 0.508: R3.1 v17.27,8.82
  Bottom 0.508: v22.4,8.82 v17.27,8.82
V_PIXEL
  Top 0.254: C10.1 22.3,13.95 R4.2 21.5,13.9 | U1.3 20.9,9.88 21.2,10.18 21.2,11.18
  Top 0.508: 21.2,11.18 21.2,13.6 21.5,13.9
V_PIXEL_BUFF
  Top 0.254: U1.1 U1.2 18.9,10.53 18.6,10.22 18.6,7.62 18.3,7.33 R2.1
VIDEO  (via drill 0.25)
  Top 0.254: J2.7 29.5,18.3 v29.75,18.05
  Top 0.508: R4.1 v24.6,13.9
  Bottom 0.508: v24.6,13.9 29.45,13.9 30.3,14.75 30.3,17.5 v29.75,18.05
VREF
  Top 0.254: J2.2 28.7,15.8 29,15.5 29,14.45 28.8,14.25
  Top 0.508: 28.8,14.25 26.6,14.25 26.1,13.75 RP1.3
WIPER
  Top 0.508: 31.7,4.2 31.7,4.8 31,5.5 30.5,5.5 30,6 30,6.45 RP1.2
  Top 0.762: SW1.1 31.7,4.2
XTAL1
  Top 0.127: U5.7 U5.7F
  Top 0.254: U5.7F 12.08,15.25 12.58,14.75 12.58,13.5 13.73,12.35 X1.3
  Top 0.508: C9.1 12.8,11.35 X1.3
XTAL2
  Top 0.127: U5.8 U5.8F
  Top 0.254: U5.8F 17.29,15.75 17.37,15.67
  Top 0.406: X1.1 17.6,15.44 17.37,15.67
  Top 0.508: C8.1 18.75,14.65 X1.1

### Text on the board
tPlace: SPI Slave | sensor / interface | TxRx | Done | OFF | X | i2c: / 2.2k | CCW: | Show / dark | ON | pull-ups | SCL | gpio/ / i2c | DarkC | SDA
bPlace: 20190429-dev-kit / vis-spi-out / sensor-interface
tTest: MISO | MOSI | SS~ | DR | RST~ | SCK | +3.3V | GND | GND | 3.3V | SCK | ~RST | DR | ~SS | MOSI | MISO
Reference: BOARD DIMENSION | 1. Board dimension: 34 x 29 mm. | SPI INTERFACE to usb-bridge | FFC | # View all / dis all; dis -27 -28 -44 / / # View with less noise / dis all; dis -27 -28 -44 -201 -202 -39 -29 -30 -31 -32 -21 -22 -25 -26 / / # Silk to print: / dis 21 22 37 201 202